# EAGLE design sym-var4 (EAGLE 7.5.0)
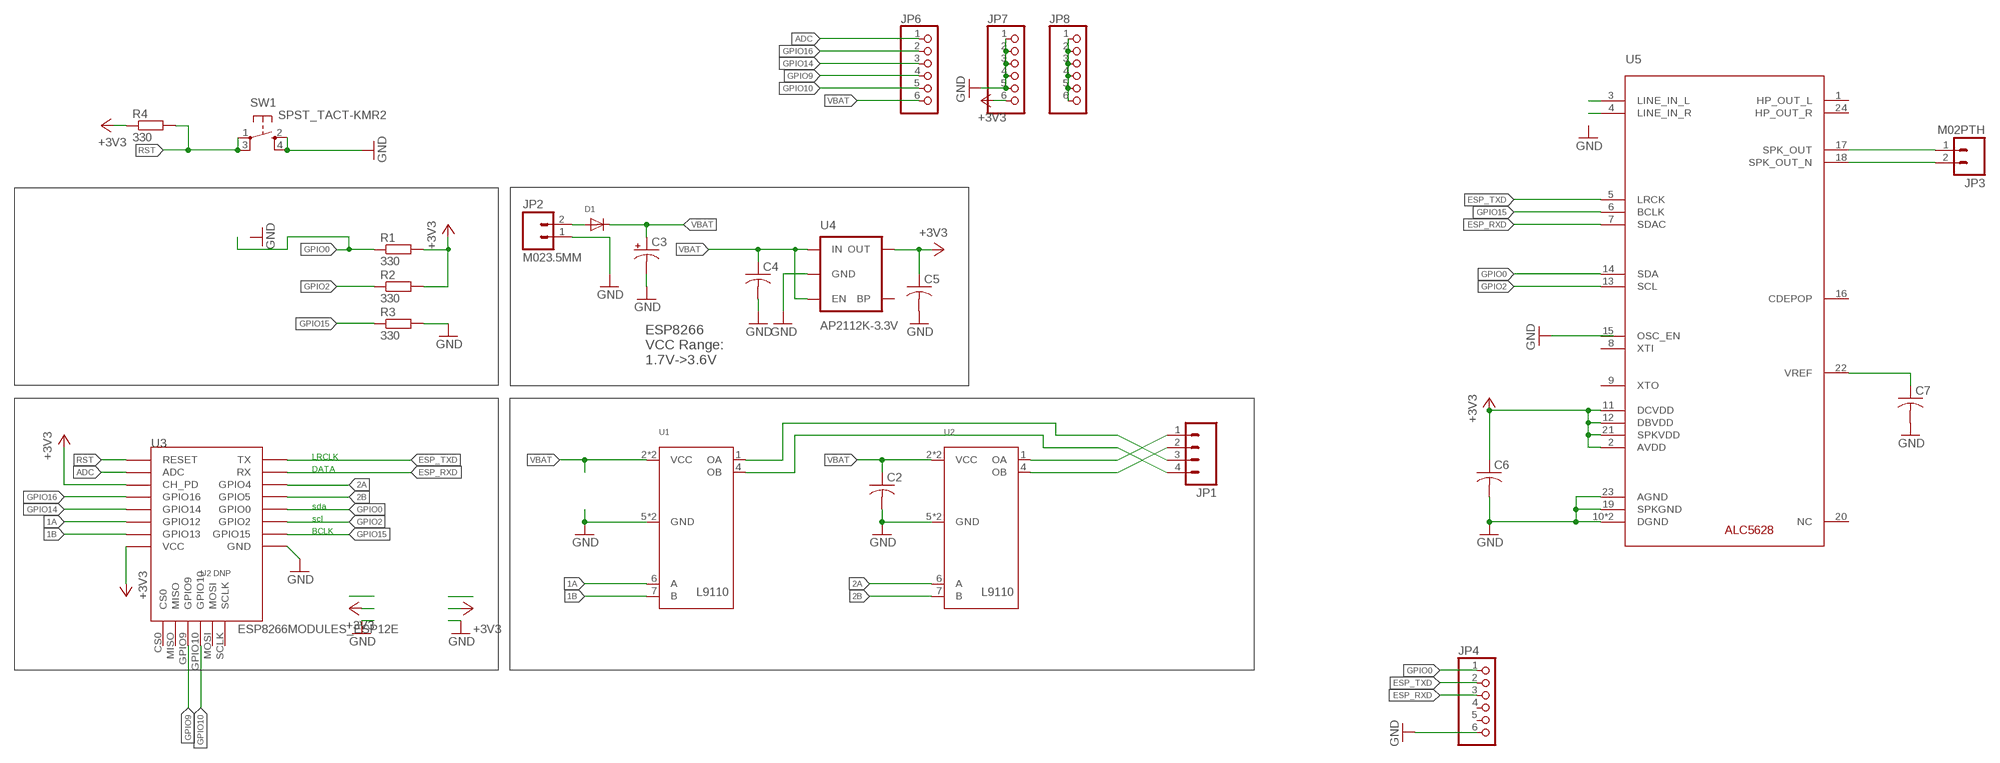
[diagram p0: schematic, sheet 1]

## Parts
C2  C-USC0805  [C0805]
C3  CPOL-USE2-5  [E2-5]
C4  C-USC0805  [C0805]
C5  C-USC0805  [C0805]
C6  C-USC0805  [C0805]
C7  C-USC0805  [C0805]
D1  DIODESMA  [SMADIODE]
JP1  M04SCREW  [SCREWTERMINAL-3.5MM-4]
JP2  M023.5MM  [SCREWTERMINAL-3.5MM-2]
JP3  M02PTH  [1X02]
JP4  PINHD-1X6  [1X06]
JP6  PINHD-1X6  [1X06]
JP7  PINHD-1X6  [1X06]
JP8  PINHD-1X6  [1X06]
R1  330  R-EU_R0805  [R0805]
R2  330  R-EU_R0805  [R0805]
R3  330  R-EU_R0805  [R0805]
R4  330  R-EU_R0805  [R0805]
SW1  SPST_TACT-KMR2  [KMR2]
U1  L9110  [DIP8]
U2  L9110  [DIP8]
U3  ESP8266MODULES_ESP12E  [ESP8266MODULES_ESP12E]
U4  AP2112K-3.3V  V_REG_LDOSMD  [SOT23-5]
U5  ALC5628  [QFN24]

## Nets
1A: U1.6(A) U3.GPIO12
1B: U1.7(B) U3.GPIO_13(GPIO13)
2A: U2.6(A) U3.GPIO4
2B: U2.7(B) U3.GPIO5
+3V3: C5.1 C6.1 JP7.6 R1.2 R2.2 R4.1 U3.CH_PD U3.VCC U4.5(OUT) U5.2(AVDD) U5.11(DCVDD) U5.12(DBVDD) U5.21(SPKVDD)
ADC: JP6.1 U3.ADC
ESP_RXD: JP4.3 U3.RX U5.7(SDAC)
ESP_TXD: JP4.2 U3.TX U5.5(LRCK)
GND: C2.2 C3.- C4.2 C5.2 C6.2 C7.2 JP2.1 JP4.6 JP7.1 JP7.2 JP7.3 JP7.4 JP7.5 R3.2 SW1.2(S) SW1.4(S1) U1.5(GND) U1.8(GND) U2.5(GND) U2.8(GND) U3.GND U4.2(GND) U5.10(DGND) U5.19(SPKGND) U5.23(AGND) U5.PAD(DGND)
GPIO0: JP4.1 R1.1 U3.GPIO0 U5.14(SDA)
GPIO2: R2.1 U3.GPIO2 U5.13(SCL)
GPIO9: JP6.4 U3.GPIO9
GPIO10: JP6.5 U3.GPIO10
GPIO14: JP6.3 U3.GPIO14
GPIO15: R3.1 U3.GPIO15 U5.6(BCLK)
GPIO16: JP6.2 U3.GPIO_16(GPIO16)
N$1: JP1.1 U2.1(OA)
N$2: JP1.2 U2.4(OB)
N$3: JP1.4 U1.4(OB)
N$4: JP1.3 U1.1(OA)
N$5: D1.A JP2.2
N$6: C7.1 U5.22(VREF)
N$9: JP8.1 JP8.2 JP8.3 JP8.4 JP8.5 JP8.6
N$12: JP3.1 U5.17(SPK_OUT)
N$13: JP3.2 U5.18(SPK_OUT_N)
N$14: U5.3(LINE_IN_L)
N$15: U5.4(LINE_IN_R)
RST: R4.2 SW1.1(P) SW1.3(P1) U3.RESET
VBAT: C2.1 C3.+ C4.1 D1.C JP6.6 U1.2(VCC) U1.3(VCC) U2.2(VCC) U2.3(VCC) U4.1(IN) U4.3(EN)
Unconnected: JP4.4 JP4.5 U3.CS0 U3.MISO U3.MOSI U3.SCLK U4.4(BP) U5.1(HP_OUT_L) U5.8(XTI) U5.9(XTO) U5.15(OSC_EN) U5.16(CDEPOP) U5.20(NC) U5.24(HP_OUT_R)

## Notes on the sheet
- ESP8266
  VCC Range:
  1.7V->3.6V
- LRCLK
- DATA
- sda
- scl
- BCLK
- U2 DNP

## Library data of the parts
C2 C4-C7 = adafruit:C-US: CAPACITOR, American symbol
C3 = rcl:CPOL-US: POLARIZED CAPACITOR, American symbol
D1 = adafruit:DIODE: Diode SMADIODE - SMA Surface Mount Package 20V 1A Schottky Diode Digikey: 641-1014-6-ND DO-1N4148 - Through Hole Small Current Diode SOD-123 20V 1 A (.5mV Vf) Schottky Diode - Digikey: MBRX120TPMSCT-ND SOD-323 10V 570mA (.38mV Vf, 3ns) Schottky Diode - Digikey: ZLLS410CT-ND SOD-523 30V 30mA Schottky Diode (RB751S-40TE61) - Digikey: RB751S-40TE61CT-ND SOT23-R/W - SOT23 Package (R = Solder Paste/Reflow Ovens, W = Hand-Soldering) BAT54Film 40V 300mA - Digikey: 497-7162-1-ND
JP1 = SparkFun-Connectors:M04: Header 4 Standard 4-pin 0.1" header. Use with straight break away headers (SKU : PRT-00116), right angle break away headers (PRT-00553), swiss pins (PRT-00743), machine pins (PRT-00117), and female headers (PRT-00115). Molex polarized connector foot print use with SKU : PRT-08231 with associated crimp pins and housings. 1MM SMD Version SKU: PRT-10208
JP2 JP3 = SparkFun-Connectors:M02: Standard 2-pin 0.1" header. Use with - straight break away headers ( PRT-00116) - right angle break away headers (PRT-00553) - swiss pins (PRT-00743) - machine pins (PRT-00117) - female headers (PRT-00115) Molex polarized connector foot print use with: PRT-08233 with associated crimp pins and housings. 2.54_SCREWTERM for use with PRT-10571. 3.5mm Screw Terminal footprints for PRT-08084 5mm Screw Terminal footprints for use with PRT-08432
JP4 JP6-JP8 = adafruit:PINHD-1X6: PIN HEADER
R1-R4 = rcl:R-EU_: RESISTOR, European symbol
SW1 = adafruit:SPST_TACT: SMT 6mm switch, EVQQ2 series http://www.ladyada.net/library/eagle
U1 U2 = L9110h:L9110
U3 = sym-var2:ESP8266MODULES_ESP12E
U4 = SparkFun-PowerIC:V_REG_LDO: Voltage Regulator LDO Standard 150mA LDO voltage regulator in SOT-23 layout. Micrel part MIC5205. BP (by-pass) pin is used to lower output noise with 470pF cap.; PROD_ID: VREG-12457
U5 = ALC5628:ALC5628

## Board
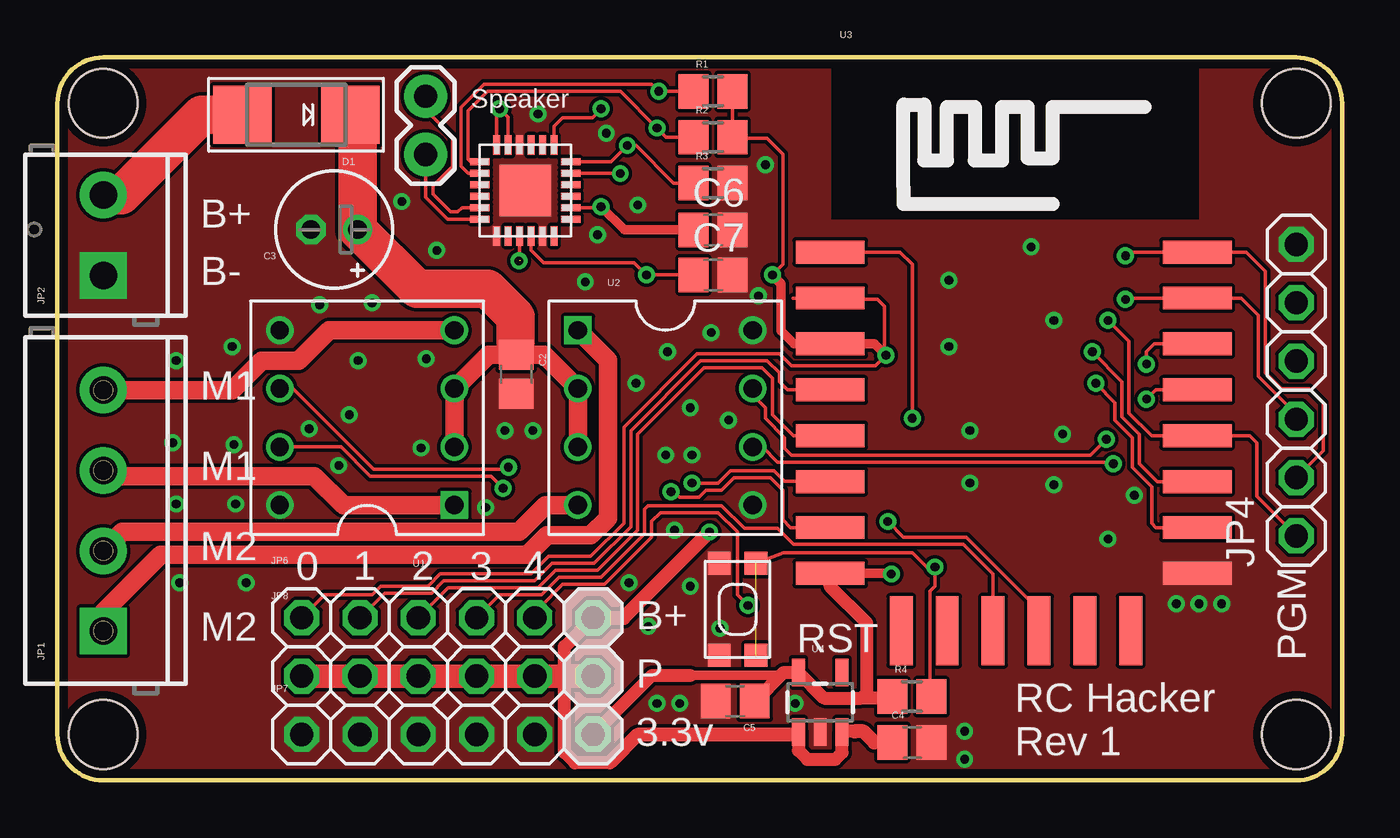
[diagram p1: board, top side]
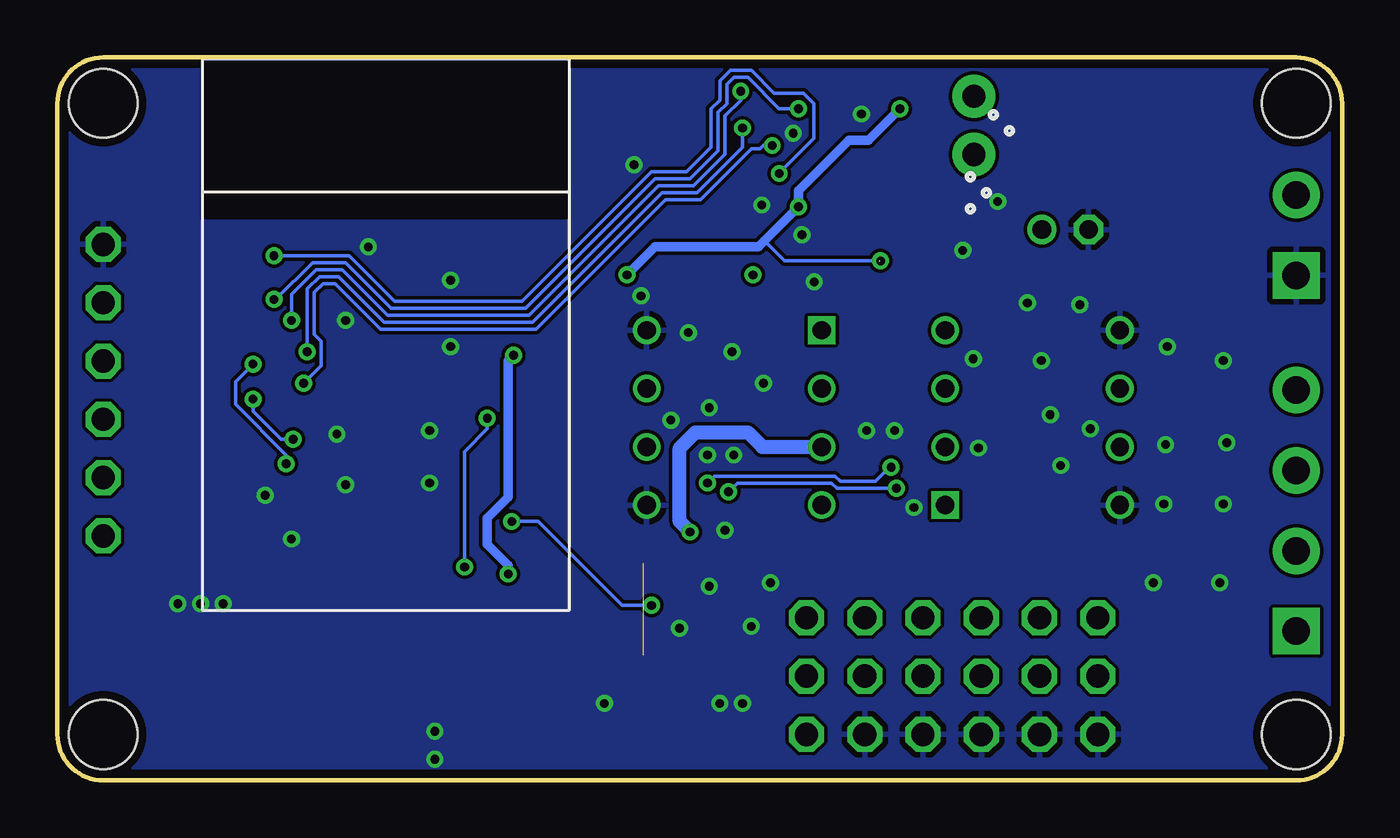
[diagram p2: board, bottom side, seen from below]

Size 56 x 31.5 mm. Coordinates in mm from the lower left corner, seen from the top.
Outline: 2,0 arc-90 0,2 0,29.5 arc-90 2,31.5 54,31.5 arc-90 56,29.5 56,2 arc-90 54,0 2,0
Copper layers (1*16): Top 0.0356mm / dielectric 1.5011mm / Bottom 0.0356mm
Design rules "LaenPCBOrder": minimum track width 6mil, minimum drill 13mil, track to track 6mil, track to pad 6mil, pad to pad 6mil, via to via 6mil, smd to smd 6mil, copper to edge 15mil, drill to drill 6mil, minimum pad ring 7mil, minimum via ring 7mil, stop-mask expansion 3mil, vias tented up to drill 0mil, thermal gap 10mil
Holes 3 mm at 2,2 2,29.5 54,2 54,29.5
tRestrict: area 33.8,24.4 to 49.8,31.2
bRestrict: area 33.8,24.4 to 49.8,31.2

### Footprints (pad centres in the part's own frame; a part is rotated, then mirrored left to right if it is on the bottom)
C0805 = smd 1.3 x 1.5: 1 -0.85,0; 2 0.85,0
E2-5 = drill 0.813 pad 1.27: + -1.016,0 | drill 0.813 pad 1.27 octagon: - 1.016,0
SMADIODE = smd 2.54 x 2.54: A 2.349,0; C -2.349,0
SCREWTERMINAL-3.5MM-4 = drill 1.2 pad 2.032 square: 1 0,0 | drill 1.2 pad 2.032: 2 3.5,0; 3 7,0; 4 10.5,0
SCREWTERMINAL-3.5MM-2 = drill 1.2 pad 2.032 square: 1 0,0 | drill 1.2 pad 2.032: 2 3.5,0
1X02 = drill 1.016 pad 1.88: 1 0,0; 2 2.54,0
1X06 = drill 1.016 octagon: 1 -6.35,0; 2 -3.81,0; 3 -1.27,0; 4 1.27,0; 5 3.81,0; 6 6.35,0
R0805 = smd 1.3 x 1.5: 1 -0.85,0; 2 0.85,0
KMR2 = smd 1 x 1: 1 2,0.8; 2 2,-0.8; 3 -2,0.8; 4 -2,-0.8
DIP8 = drill 0.8 square: 1 -3.81,-3.81 | drill 0.8: 2 -1.27,-3.81; 3 1.27,-3.81; 4 3.81,-3.81; 5 3.81,3.81; 6 1.27,3.81; 7 -1.27,3.81; 8 -3.81,3.81
ESP8266MODULES_ESP12E = smd 3 x 1: ADC -8.1,3.8; CH_PD -8.1,1.8; GND 7.9,-8.2; GPIO0 7.9,-2.2; GPIO2 7.9,-4.2; GPIO4 7.9,1.8; GPIO5 7.9,-0.2; GPIO12 -8.1,-4.2; GPIO14 -8.1,-2.2; GPIO15 7.9,-6.2; GPIO_13 -8.1,-6.2; GPIO_16 -8.1,-0.2; RESET -8.1,5.8; RX 7.9,3.8; TX 7.9,5.8; VCC -8.1,-8.2 | smd 1 x 3: CS0 -5,-10.7; GPIO9 -1,-10.7; GPIO10 1,-10.7; MISO -3,-10.7; MOSI 3,-10.7; SCLK 5,-10.7
SOT23-5 = smd 0.55 x 1.2: 1 -0.95,-1.3; 2 0,-1.3; 3 0.95,-1.3; 4 0.95,1.3; 5 -0.95,1.3
QFN24 = smd 0.85 x 0.3: 1 -1.975,1.25; 2 -1.975,0.75; 3 -1.975,0.25; 4 -1.975,-0.25; 5 -1.975,-0.75; 6 -1.975,-1.25; 13 1.975,-1.25; 14 1.975,-0.75; 15 1.975,-0.25; 16 1.975,0.25; 17 1.975,0.75; 18 1.975,1.25 | smd 0.3 x 0.85: 7 -1.25,-1.975; 8 -0.75,-1.975; 9 -0.25,-1.975; 10 0.25,-1.975; 11 0.75,-1.975; 12 1.25,-1.975; 19 1.25,1.975; 20 0.75,1.975; 21 0.25,1.975; 22 -0.25,1.975; 23 -0.75,1.975; 24 -1.25,1.975 | smd 2.25 x 2.25: PAD 0,0

### Placement (x,y rotation side)
C2  20,17.7 270 top
C3  12.07,24 180 top
C4  37.25,1.65 0 top
C5  29.55,3.45 180 top
C6  28.58,23.98 0 top
C7  28.58,22.02 0 top
D1  10.42,29 180 top
JP1  2,6.5 90 top
JP2  2,22 90 top
JP3  16.05,29.81 270 top
JP4  54,17 90 top
JP6  17,7.08 0 top
JP7  17,2 0 top
JP8  17,4.54 0 top
R1  28.58,30.02 0 top
R2  28.58,28.02 0 top
R3  28.58,26.02 0 top
R4  37.25,3.65 0 top
SW1  29.65,7.45 270 top
U1  13.5,15.8 90 top
U2  26.5,15.8 270 top
U3  41.78,17.22 0 top
U4  33.25,3.4 0 top
U5  20.4,25.7 180 top

### Tracks (layer width: path | path; a pad name or v marks a point on that pad's centre or on a via)
1A  (via drill 0.38)
  Top 0.152: U1.6 10.29,17.07 13.79,13.56 19.58,13.56 v19.66,13.64 | v27.66,12.95 28.8,12.95 29.34,13.49 31.24,13.49 31.7,13.03 33.67,13.03 U3.GPIO12
  Bottom 0.152: v19.66,13.64 19.74,13.64 20.34,13.03 21.87,13.03 22.1,13.26 27.36,13.26 v27.66,12.95
1B  (via drill 0.38)
  Top 0.152: U1.7 12.37,14.53 13.64,13.26 18.9,13.26 v19.43,12.72 | v26.75,12.57 26.9,12.57 27.13,12.34 27.96,12.34 28.27,12.65 28.96,12.65 29.49,13.18 31.09,13.18 31.62,12.65 31.62,11.35 31.96,11.02 U3.GPIO_13
  Bottom 0.152: v19.43,12.72 22.02,12.72 22.25,12.95 26.36,12.95 v26.75,12.57
2A  (via drill 0.38)
  Top 0.152: U2.6 30.73,14.53 31.39,13.87 45.95,13.87 v46.02,13.79 | v47.47,18.14 47.47,18.67 47.82,19.02 U3.GPIO4
  Bottom 0.152: v46.02,13.79 46.02,14.17 48.23,16.38 48.23,17.37 v47.47,18.14
2B  (via drill 0.38)
  Top 0.152: U2.7 30.31,16.78 30.86,16.23 30.86,15.77 31.7,14.94 31.7,14.48 32,14.17 45.03,14.17 v45.72,14.86 | v47.47,16.61 47.88,17.02 U3.GPIO5
  Bottom 0.152: v45.72,14.86 46.25,14.86 47.47,16.08 v47.47,16.61
+3V3  (via drill 0.38)  (1 unrouted)
  Top 0.152: U5.21 20.15,22.63 v20.12,22.63 | U5.2 23.66,24.95 v23.7,24.99 | U5.11 19.65,28.89 v19.28,29.26 19.15,29.13 U5.12 | R1.2 R2.2 29.48,27.96 30.94,27.96 31.62,27.28 31.62,22.48 v31.17,22.02
  Top 0.406: C6.1 24.71,23.98 v23.7,24.99 | v31.17,22.02 31.55,21.64 31.55,19.58 32.12,19.02 U3.CH_PD 35.62,19.02 v36.12,18.52 | v36.35,8.99 36.32,9.02 U3.VCC | 27.58,4.57 31.52,4.57 31.65,4.7
  Top 0.559: 35.05,3.58 33.42,3.58 U4.5 31.65,4.7 C5.1 30.4,3.89 | 35.05,3.58 35.28,3.81 35.28,6.86 33.68,8.46 U3.VCC | R4.1 36.33,3.58 35.05,3.58 | JP7.6 25.92,4.57 27.58,4.57
  Bottom 0.152: v23.7,24.99 23.77,24.99 | v19.28,29.26 19.28,29.18 | 20.19,22.63 24.31,22.63 25.18,23.51
  Bottom 0.406: v31.17,22.02 29.95,23.24 25.45,23.24 25.18,23.51 v23.7,24.99 23.7,25.68 21.49,27.89 20.65,27.89 v19.28,29.26 | v36.12,18.52 36.35,18.29 36.35,12.34 37.26,11.43 37.26,10.29 36.35,9.37 v36.35,8.99
ADC
  Top 0.152: JP6.1 11.65,8.08 13.72,8.08 14.1,8.46 16.15,8.46 16.69,8.99 20.65,8.99 21.41,9.75 23.24,9.75 24.69,11.2 24.69,15.39 27.89,18.59 31.47,18.59 32,18.06 35.66,18.06 36.04,18.44 36.04,20.65 35.74,20.95 34.29,20.95 34.23,21.02 U3.ADC 32.06,21.02
ESP_RXD  (via drill 0.38)
  Top 0.152: U5.7 21.65,28.51 22.02,28.88 23.32,28.88 v23.7,29.26 | v46.56,20.95 46.62,21.02 U3.RX 51.6,21.02 52.35,20.27 52.35,17.6 54,15.95 JP4.3
  Bottom 0.152: 23.77,29.26 v23.7,29.26 24.54,29.26 25.91,30.63 26.52,30.63 26.82,30.33 26.82,29.49 27.2,29.11 27.2,27.43 28.42,26.21 29.95,26.21 35.59,20.57 41.45,20.57 43.43,22.55 44.88,22.55 46.48,20.95 v46.56,20.95
ESP_TXD  (via drill 0.38)
  Top 0.152: U5.5 24.53,26.45 v24.54,26.44 | v46.56,22.86 46.71,23.02 U3.TX 51.81,23.02 52.65,22.17 52.65,17.75 53.34,17.07 54.56,17.07 55.17,16.46 55.17,14.36 JP4.2
  Bottom 0.152: 24.61,26.36 v24.54,26.44 23.01,27.96 23.01,29.49 23.47,29.95 24.77,29.95 25.76,30.94 26.67,30.94 27.13,30.48 27.13,29.64 27.51,29.26 27.51,27.58 28.57,26.52 30.1,26.52 35.74,20.88 41.3,20.88 43.28,22.86 v46.56,22.86
GND  (via drill 0.38)
  other vias: 27.13,3.35 32.16,3.35 39.55,0.91 39.55,2.13 50.75,7.7 49.76,7.7 48.77,7.7 30.86,26.82 30.56,21.11 28.88,6.63 20.73,15.24 19.51,15.24 43.43,20.04 38.86,18.9 38.86,21.79 42.44,23.24 29.26,15.7 27.58,16.23 27.66,14.17 26.52,14.17 18.67,11.89 12.27,13.72 10.97,15.32 8.23,8.61 5.33,8.61 7.77,12.04 5.18,12.04 7.7,14.63 5.03,14.71 7.62,18.9 5.18,18.29 13.72,20.8 11.43,20.73 16.08,18.36 13.11,18.29 15.85,14.48 12.73,15.93 28.5,19.51 26.59,18.67 25.22,17.3 45.8,10.52 43.43,12.88 39.78,12.95 39.78,15.24 43.81,15.09 46.94,12.42 26.14,3.35 26.9,10.9 24.92,8.61 27.58,8.46 25.76,6.71 23.55,23.77 25.3,25.07 23.93,28.19 20.95,29.03 16.54,23.09 15.01,25.22 23.01,21.72
  pour Top (no thermals): -8,35 78,35 78.5,-5.5 1,-9.5 -9.5,11.5
  pour Bottom: -6.05,36.6 59.3,36.6 59.3,-4.4 -4.4,-4.4 -4.4,31.5
GPIO0  (via drill 0.38)
  Top 0.152: U5.14 17.9,26.45 17.6,26.75 17.6,29.34 18.59,30.33 25.91,30.33 v26.21,30.02 v26.22,30.02 R1.1 | v45.8,20.04 46.71,19.13 46.71,16 47.7,15.02 U3.GPIO0 51.96,15.02 52.27,14.71 52.27,12.38 JP4.1
  Bottom 0.152: 26.29,30.02 v26.21,30.02 26.21,29.64 26.9,28.96 26.9,27.28 28.27,25.91 29.79,25.91 35.43,20.27 41.6,20.27 43.59,22.25 44.73,22.25 45.8,21.18 v45.8,20.04
GPIO2  (via drill 0.38)
  Top 0.152: U5.13 18.01,26.95 17.91,27.05 17.91,29.18 18.75,30.02 24.54,30.02 v26.14,28.42 26.54,28.02 R2.1 | U3.GPIO2 47.94,13.02 47.17,13.79 47.17,15.09 46.41,15.85 46.41,17.37 v45.11,18.67
  Bottom 0.152: 26.21,28.42 v26.14,28.42 26.14,27.58 28.12,25.6 29.64,25.6 35.28,19.96 41.76,19.96 43.74,21.95 44.58,21.95 45.11,21.41 v45.11,18.67
GPIO9
  Top 0.152: JP6.4 19.27,8.08 21.11,8.08 21.87,8.84 23.7,8.84 25.6,10.74 25.6,11.81 25.76,11.96 28.96,11.96 29.95,10.97 31.39,10.97 32.08,10.29 39.49,10.29 40.78,8.99 U3.GPIO9
GPIO10  (via drill 0.38)
  Top 0.152: JP6.5 21.04,7.55 22.02,8.53 23.85,8.53 25.91,10.59 25.91,11.28 26.29,11.66 28.8,11.66 29.64,10.82 29.64,8.08 v30.1,7.62 | U3.GPIO10 42.78,7.43 39.62,10.59 36.88,10.59 v36.2,11.28
  Bottom 0.152: v36.2,11.28 35.05,11.28 31.39,7.62 v30.1,7.62
GPIO14
  Top 0.152: JP6.3 17.03,8.38 20.95,8.38 21.72,9.14 23.55,9.14 25.3,10.9 25.3,15.09 28.19,17.98 30.71,17.98 31.17,17.53 31.17,15.93 32.08,15.02 U3.GPIO14
GPIO15  (via drill 0.38)
  Top 0.152: U5.6 24.13,26.95 v24.84,27.66 25.22,27.66 26.86,26.02 R3.1 | U3.GPIO15 47.89,11.02 47.7,11.2 47.7,12.8 46.86,13.64 46.86,14.94 46.1,15.7 46.1,16.46 v45.26,17.3
  Bottom 0.152: 24.92,27.66 v24.84,27.66 25.22,27.66 25.38,27.51 25.76,27.51 27.96,25.3 29.49,25.3 35.13,19.66 41.91,19.66 43.89,21.64 44.42,21.64 44.81,21.26 44.81,19.43 44.5,19.13 44.5,18.06 v45.26,17.3
GPIO16
  Top 0.152: JP6.2 14.26,8.15 16.31,8.15 16.84,8.69 20.8,8.69 21.57,9.45 23.39,9.45 24.99,11.05 24.99,15.24 28.04,18.29 30.94,18.29 31.47,17.75 31.47,17.37 31.83,17.02 U3.GPIO_16
N$1
  Top 0.813: U2.1 24,18.3 24,11.43 23.24,10.67 21.34,10.67 20.5,9.83 4.5,9.83 2,7.33 JP1.1
N$2
  Top 0.813: JP1.2 2.82,10.82 20.12,10.82 21.29,11.99 U2.4
N$3
  Top 0.813: JP1.4 3.5,17 3.5,16.99 7.62,16.99 8.91,18.29 10.52,18.29 11.84,19.61 U1.4
N$4
  Top 0.813: JP1.3 2.24,13.26 11.2,13.26 12.47,11.99 U1.1
N$5
  Top 1.676: JP2.2 2.79,25.5 6.29,29 D1.A
N$6  (via drill 0.38)
  Top 0.152: U5.22 20.65,23.09 21.18,22.55 25.15,22.55 v25.68,22.02 C7.1
  Bottom 0.152: v25.68,22.02 25.83,22.02
N$9
  Top 1.016: JP8.6 JP8.5 JP8.4 JP8.3 JP8.2 JP8.1
N$12
  Top 0.152: U5.17 17.64,24.95 17.45,24.77 17.14,24.77 16.38,25.53 16.38,25.91 17.22,26.75 17.22,28.04 16.05,29.21 JP3.1
N$13
  Top 0.152: U5.18 17,24.45 16.05,25.4 JP3.2
RST  (via drill 0.38)  (1 unrouted)
  Top 0.152: U3.RESET 36.73,23.02 37.26,22.48 v37.26,15.77 | SW1.3 31.66,9.91 37.26,9.91 37.87,9.3 v38.25,9.3 38.25,8.46 38.02,8.23 38.02,3.73 R4.2
  Bottom 0.152: v38.25,9.3 38.25,14.33 37.26,15.32 v37.26,15.77
VBAT  (via drill 0.38)
  Top 0.559: 34.75,2.13 34.23,2.13 U4.3 34.2,1.21 33.91,0.91 32.69,0.91 32.3,1.3 U4.1 | 24.16,0.84 24.08,0.76 22.55,0.76 22.1,1.22 22.1,5.83 JP6.6
  Top 0.61: 32.3,1.97 U4.1 32.18,1.98 25.3,1.98 24.16,0.84 | C4.1 35.61,1.65 35.13,2.13 34.75,2.13 | v28.42,10.82 24.68,7.08 JP6.6
  Top 0.813: U1.2 U1.3 18.79,18.55 C2.1 | U2.3 U2.2 21.21,18.55 C2.1 | 19.96,19.13 20,19.09 C2.1
  Top 1.676: 19.96,19.13 19.96,20.19 18.75,21.41 15.67,21.41 C3.+ 13.09,28.68 D1.C
  Bottom 0.61: v28.42,10.82 28.88,11.28 28.88,14.48 28.19,15.16 25.91,15.16 25.27,14.53 U2.3

### Text on the board
tPlace: Speaker | B+ | B- | M1 | M1 | M2 | 0 | 1 | 2 | 3 | 4 | B+ | M2 | RST | PGM | P | 3.3v | RC Hacker / Rev 1